# Altium schematic sheet EIS_CO2_Power.SchDoc: CO2-Sensor Powersupply
size A4; Organization: Hahn-Schickard; Address1: Wilhelm-Schickard-Str. 10; Address2: 78052 Villingen-Schwenningen; Address3: Bernd.Ehrbrecht@Hahn-Schickard.de; DocumentNumber: 1; Revision: 1.1; SheetNumber: 2; SheetTotal: 2; PhoneNumber: 0 7721 943 137; E-Mail: Xxxx.Xxxx@Hahn-Schickard.de; ProjectName: Project File Name
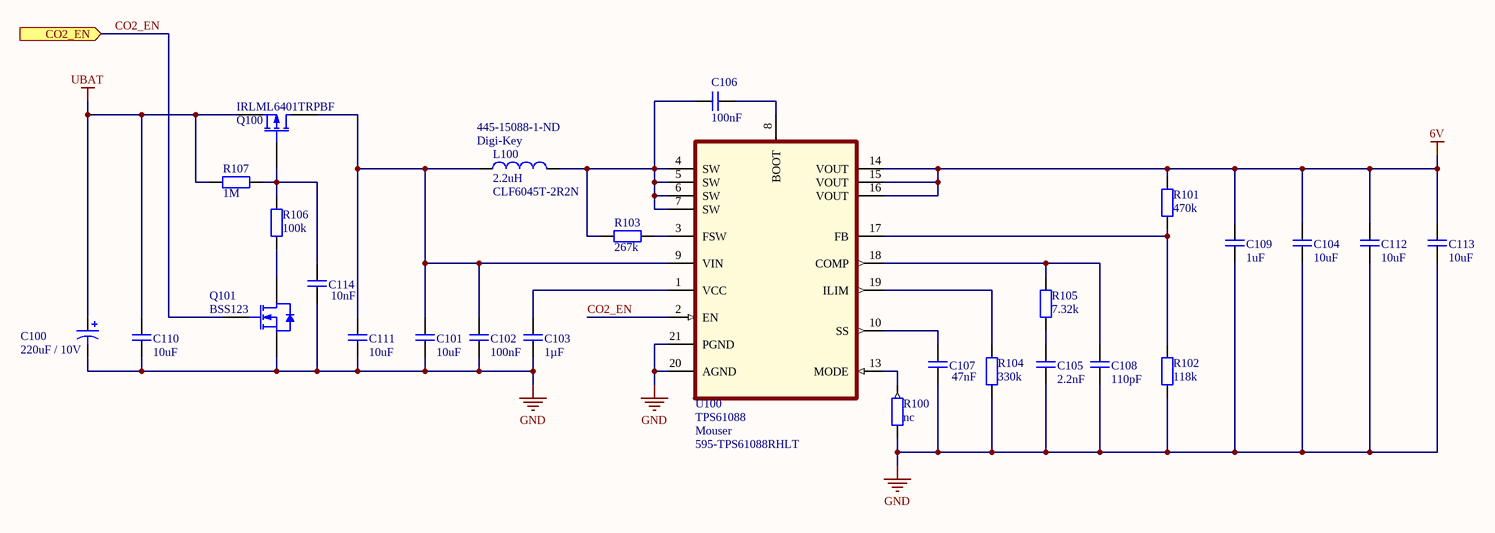
[diagram p0: EIS_CO2_Power.SchDoc]

## Parts
C100  220uF / 10V  [D]
C101  10uF  [CAPC3216N]
C102  100nF  [CAPC1608N]
C103  1µF  [CAPC1608N]
C104  10uF  [CAPC3216N]
C105  2.2nF  [CAPC1608N]
C106  100nF  [CAPC1608N]
C107  47nF  [CAPC1608N]
C108  110pF  [CAPC1608N]
C109  1uF  [CAPC3216N]
C110  10uF  [CAPC3216N]
C111  10uF  [CAPC3216N]
C112  10uF  [CAPC3216N]
C113  10uF  [CAPC3216N]
C114  10nF  [CAPC1608N]
L100  value 2.2uH  Supplier 2: Digi-Key  Supplier Part Number 2: 445-15088-1-ND  [CLF6045]  (hidden comment: CLF6045T-2R2N)
Q100  IRLML6401TRPBF  [SOT23_N]
Q101  BSS123  [SOT23_N - BSS123]
R100  nc  [RESC1608N]
R101  470k  [RESC1608N]
R102  118k  [RESC1608N]
R103  267k  [RESC1608N]
R104  330k  [RESC1608N]
R105  7.32k  [RESC1608N]
R106  100k  [RESC1608N]
R107  1M  [RESC1608N]
U100  TPS61088  Supplier 1: Mouser  Supplier Part Number 1: 595-TPS61088RHLT  [RHL0020A]

## Ports
CO2_EN (in)

## Nets
6V: C104.1 C109.1 C112.1 C113.1 R101.1 U100.14(VOUT) U100.15(VOUT) U100.16(VOUT)
GND: C100.2 C101.2 C102.1 C103.1 C104.2 C105.1 C107.1 C108.1 C109.2 C110.2 C111.2 C112.2 C113.2 C114.1 Q101.2(S) R100.2 R102.2 R104.2 U100.20(AGND) U100.21(PGND)
UBAT: C100.1 C110.1 Q100.2(S) R107.1
CO2_EN: Q101.1(G) U100.2(EN) ; port CO2_EN
NetC101_1: C101.1 C102.2 C111.1 L100.1 Q100.3(D) U100.9(VIN)
NetC103_2: C103.2 U100.1(VCC)
NetC105_2: C105.2 R105.2
NetC106_1: C106.1 L100.2 R103.2 U100.4(SW) U100.5(SW) U100.6(SW) U100.7(SW)
NetC106_2: C106.2 U100.8(BOOT)
NetC107_2: C107.2 U100.10(SS)
NetC108_2: C108.2 R105.1 U100.18(COMP)
NetC114_2: C114.2 Q100.1(G) R106.2 R107.2
NetQ101_3: Q101.3(D) R106.1
NetR100_1: R100.1 U100.13(MODE)
NetR101_2: R101.2 R102.1 U100.17(FB)
NetR103_1: R103.1 U100.3(FSW)
NetR104_1: R104.1 U100.19(ILIM)

## Notes on the sheet
- Project Name:
- Size:
- Date:
- Title:
- A4
- Time:
- Revision:
- Sheet
- of
- File:

## Library data of the parts
C100 = Cap Pol3: Polarized Capacitor (Surface Mount); Published: 8-Jun-2000; LatestRevisionDate: 17-Jul-2002; LatestRevisionNote: Re-released for DXP Platform.; PackageReference: C0805; Publisher: Altium Limited; Value: 220uF / 10V
C101-C114 = Kondensator SMD Keramik
  C101 C104 C110-C113: Value: 10uF
  C102 C106: Value: 100nF
  C103: Value: 1µF
  C105: Value: 2.2nF
  C107: Value: 47nF
  C108: Value: 110pF
  C109: Value: 1uF
  C114: Value: 10nF
L100 = Inductor: Code_IEC: 1005; Published: 8-Jun-2000; LatestRevisionDate: 29-May-2009; LatestRevisionNote: IPC-7351 Footprint Added.; PackageReference: 0402-A; Publisher: Altium Limited; PackageDescription: Chip Inductor; Code_JEITA: 0402; Supplier 1: Digi-Key; Supplier Part Number 1: CLF6045T-2R2N
Q100 = IRLML6401TRPBF: P-Channel MOSFET; Published: 8-Jun-2000; LatestRevisionDate: 17-Jul-2002; LatestRevisionNote: Re-released for DXP Platform.; PackageVersion: 1995/1996; PackageReference: E3; Publisher: Altium Limited
Q101 = BSS123: N-channel Enhancement Mode Vertical D-MOSFET; Published: 17-Sep-2003; LatestRevisionDate: 12-Dec-2006; LatestRevisionNote: IPC-7351 Footprint Added.; DatasheetVersion: Apr-1995; PackageVersion: May-1999; PackageReference: SOT23; Publisher: Altium Limited; PackageDescription: 3-Pin SOT-23 Package 0.95 mm Pitch, 2.3 mm Lead Span; ComponentLink1Description: Manufacturer Link; ComponentLink1URL: http://www.semiconductors.philips.com/; ComponentLink2Description: Datasheet; ComponentLink2URL: http://www.semiconductors.philips.com/acrobat/datasheets/BSS123_3.pdf
R100-R107 = RESC1608 (R0603): Suplier: Seller; Suplier Ordering Number: Ordering Number; Published: 14.08.2009; Publisher: HSG Jürgen Merz; ComponentLink1Description: RESC1608 (R0603) 1%
  R100: Value: nc
  R101: Value: 470k
  R102: Value: 118k
  R103: Value: 267k
  R104: Value: 330k
  R105: Value: 7.32k
  R106: Value: 100k
  R107: Value: 1M
U100 = TPS61088: Boost Schaltregler, 2,7V - 12 Uin / 4.5V-12.6V Uout / 3A / 1µA Shutdown